# EAGLE schematic Fuzz-offboard (EAGLE 6.4)
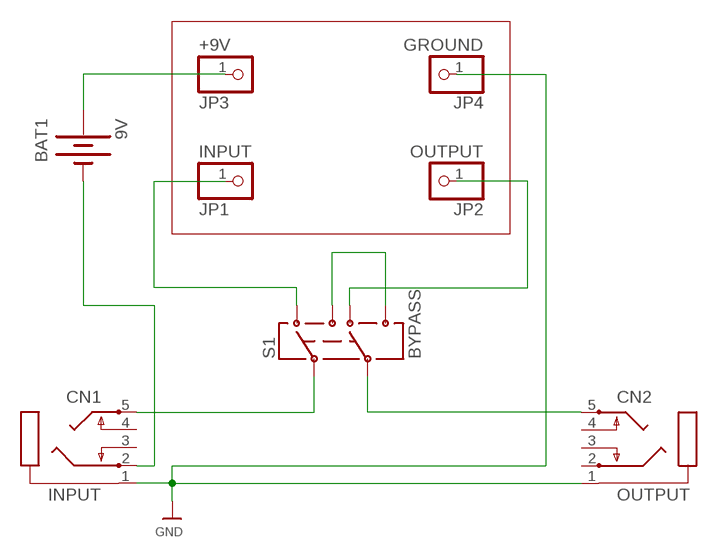
[diagram p0: schematic, sheet 1]

## Parts
BAT1  9V  BATTERY9V  [BATTCON_9V]
CN1  INPUT  AUDIO_STEREOJACK  [STX3100]
CN2  OUTPUT  AUDIO_STEREOJACK  [STX3100]
JP1  INPUT  PINHD-1X1  [1X01]
JP2  OUTPUT  PINHD-1X1  [1X01]
JP3  +9V  PINHD-1X1  [1X01]
JP4  GROUND  PINHD-1X1  [1X01]
S1  BYPASS  SWITCH-DPDTPTH1  [MS]

## Nets
GND: CN1.1 CN2.1 JP4.1
N$1: CN1.5 S1.2
N$2: CN2.5 S1.5
N$3: S1.3 S1.6
N$5: BAT1.+ JP3.1
N$6: JP2.1 S1.4
N$7: JP1.1 S1.1
N$9: BAT1.- CN1.2
Unconnected: CN1.3 CN1.4 CN2.2 CN2.3 CN2.4

## Library data of the parts
BAT1 = SparkFun-Electromechanical:BATTERY: Battery Holders Various common sizes : AA, AAA, 20mm coin cell and 12mm coin cell. 20MM_4LEGS, BATT-10373
CN1 CN2 = microbuilder:AUDIO_STEREOJACK: MIC/HEADPHONE JACK Stereo jack with two switches. Kycon STX3100, CUI SJ1-3555NG and/or 4UCon 05544 Digikey: CP1-3555NG-ND Shamelessly taken from the Adafruit Eagle library (public domain) ... thanks! These are normally connected as follows, from right-to-left on the schematic symbol above: Tip: Left Audio Inner Ring: Right Audio Shell: Common/GND
JP1-JP4 = adafruit:PINHD-1X1: Pin header 1x1 for 0.1" spacing With round pins
S1 = SparkFun-Electromechanical:SWITCH-DPDT: DPDT Version of the COM-00597